# Altium project WTC_SPI_v2.PrjPcb
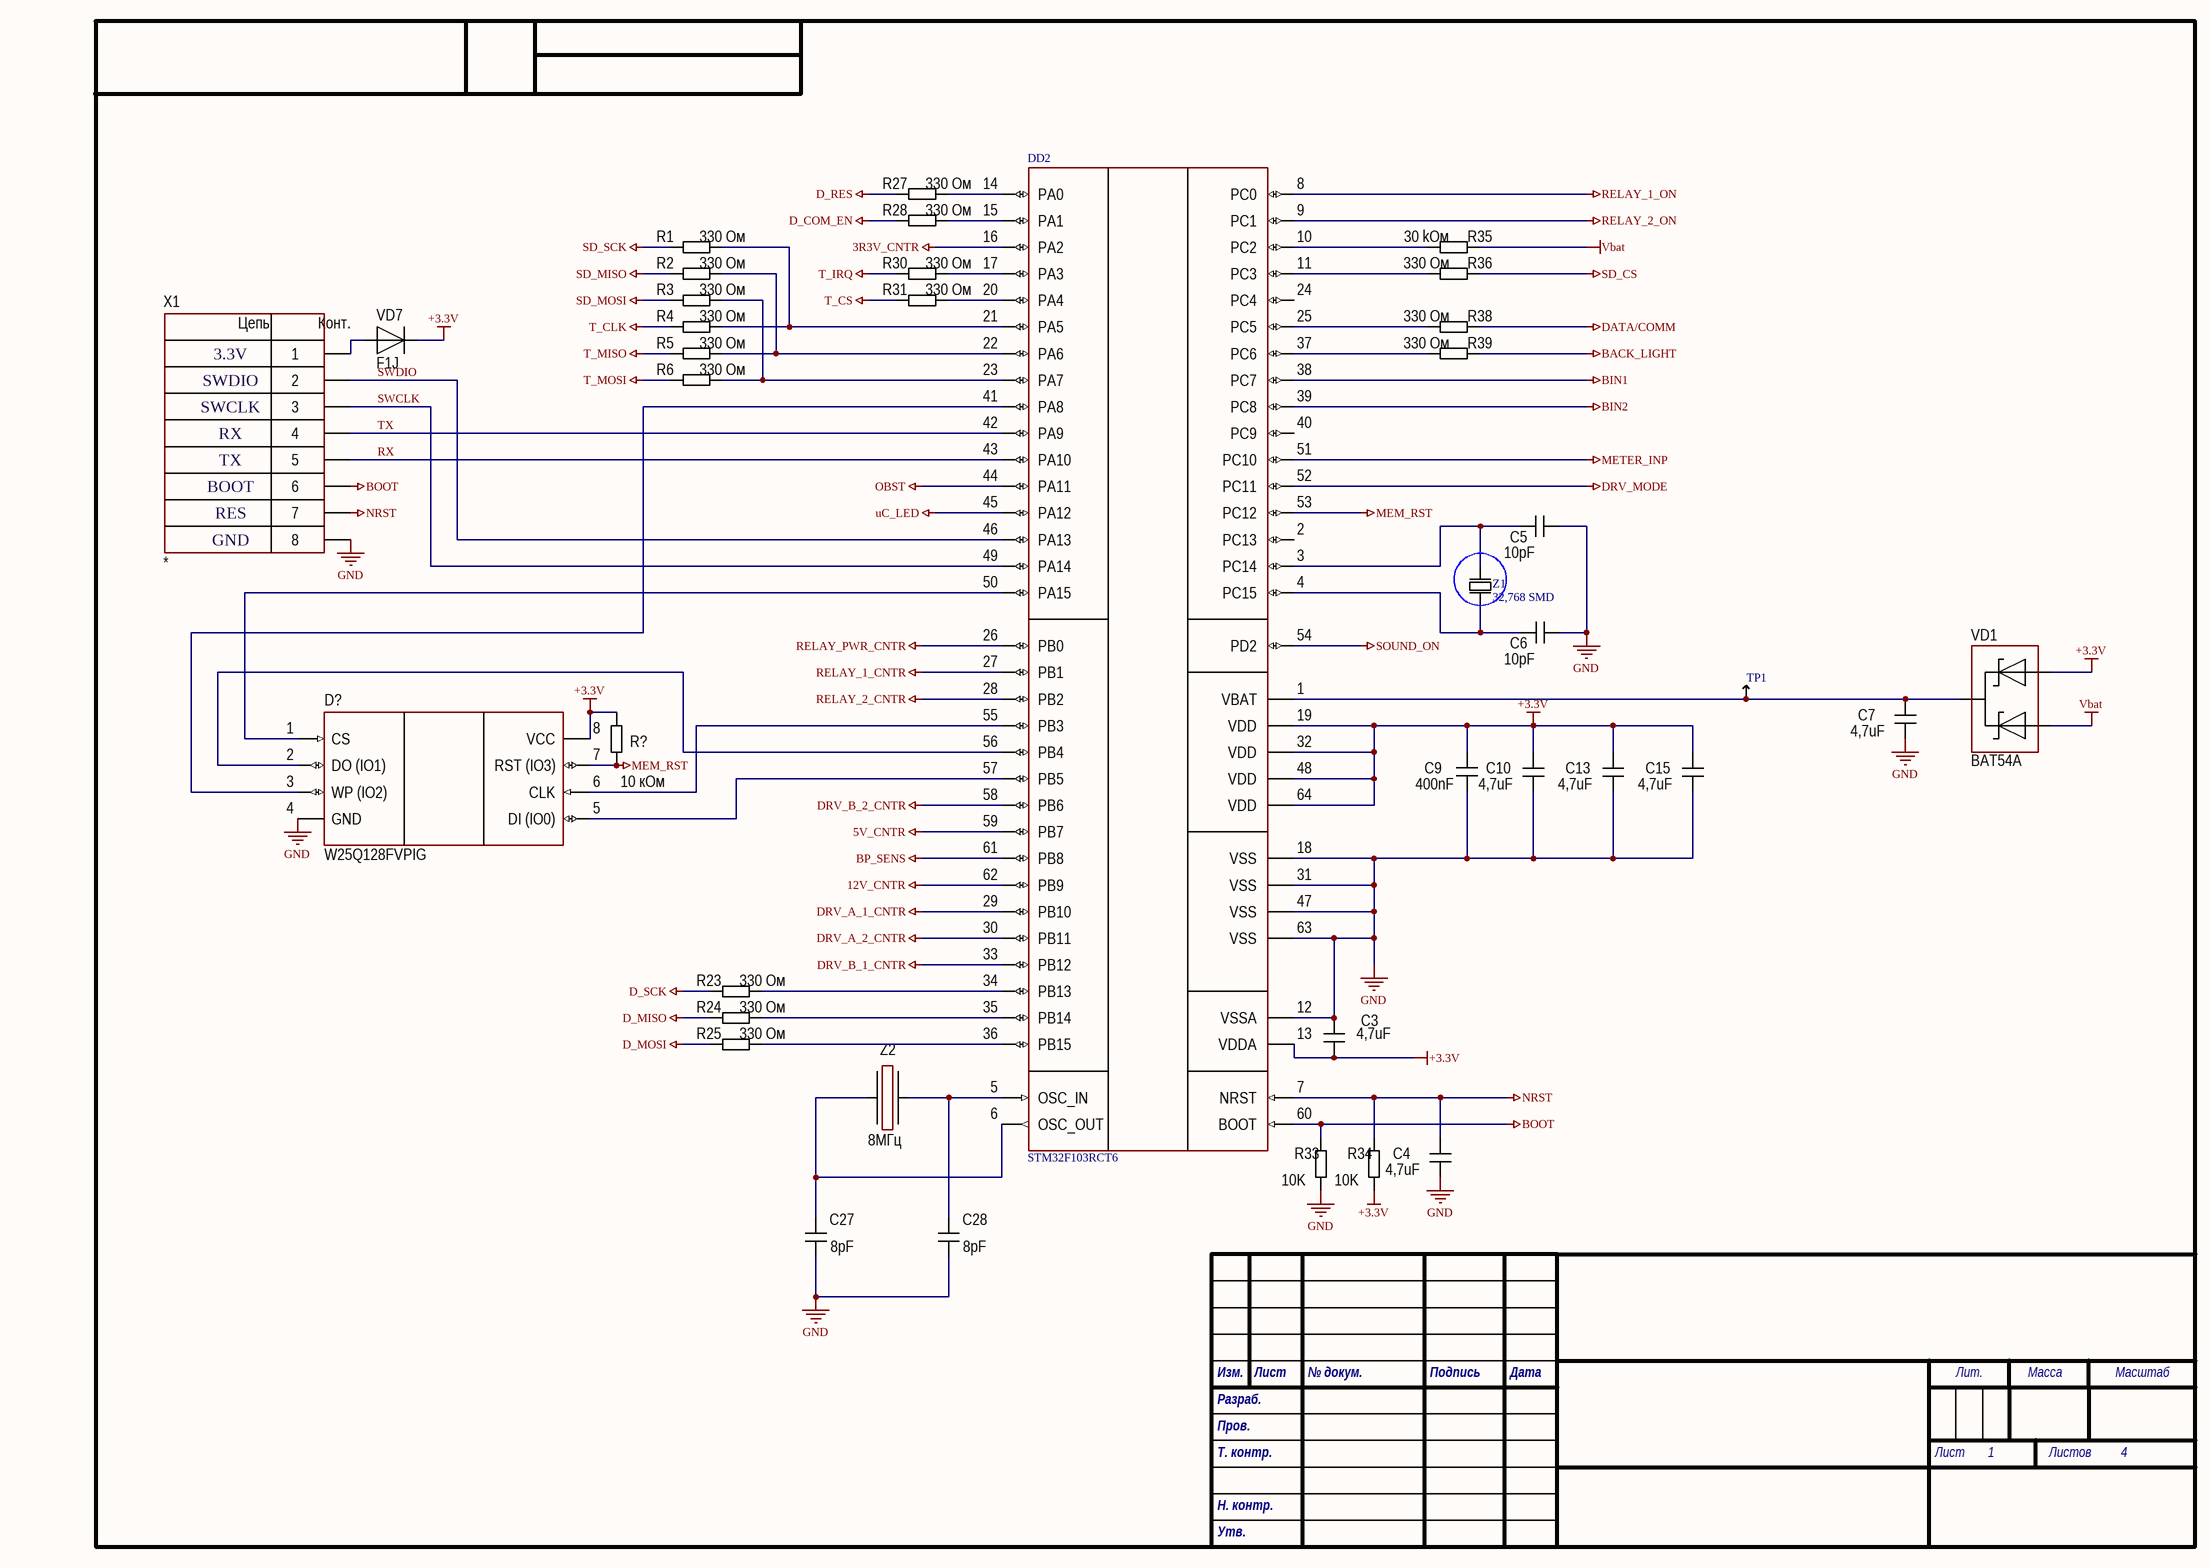
[diagram p0: 1_uC.SchDoc]
4 sheets, 167 parts. Net scope: global (net labels, ports and power ports of the same name join across sheets).
Sheets:
  1_uC.SchDoc
  2_PowerPerif.SchDoc
  3_InfoPerif.SchDoc
  4_PowerSupplie.SchDoc

## Sheet 1_uC.SchDoc
size 414 x 293 mm; SheetNumber: 1; SheetTotal: 4

### Parts
C3  4,7uF  [CH0402C]
C4  4,7uF  [CH0402C]
C5  10pF  [CH0402C]
C6  10pF  [CH0402C]
C7  4,7uF  [CH0402C]
C9  400nF  [CH0402C]
C10  4,7uF  [CH0402C]
C13  4,7uF  [CH0402C]
C15  4,7uF  [CH0402C]
C27  8pF  [CH0402C]
C28  8pF  [CH0402C]
D?  W25Q128FVPIG  [8-WSON (5x6 mm)]
DD2  STM32F103RCT6  [64-LQFP]
R1  330 Ом  [CH0603R]
R2  330 Ом  [CH0603R]
R3  330 Ом  [CH0603R]
R4  330 Ом  [CH0603R]
R5  330 Ом  [CH0603R]
R6  330 Ом  [CH0603R]
R23  330 Ом  [CH0603R]
R24  330 Ом  [CH0603R]
R25  330 Ом  [CH0603R]
R27  330 Ом  [CH0603R]
R28  330 Ом  [CH0603R]
R30  330 Ом  [CH0603R]
R31  330 Ом  [CH0603R]
R33  10K  [CH0805R]
R34  10K  [CH0805R]
R35  30 kОм  [CH0603R]
R36  330 Ом  [CH0603R]
R38  330 Ом  [CH0603R]
R39  330 Ом  [CH0603R]
R?  10 кОм  [CH0603R]
TP1  TestPoint  (value not drawn)
VD1  BAT54A  [SOT23_123]
VD7  F1J  [SOD123F]
X1  *  [CON: PLS-8]
Z1  32,768 SMD  [SMD 32.768KHz]
Z2  8МГц  [OSC: ABM3]

### Nets
3R3V_CNTR: DD2.16(PA2)
5V_CNTR: DD2.59(PB7)
12V_CNTR: DD2.62(PB9)
+3.3V: C3.1 C9.1 C10.2 C13.2 C15.2 D?.8(VCC) DD2.13(VDDA) DD2.19(VDD) DD2.32(VDD) DD2.48(VDD) DD2.64(VDD) R34.1 R?.2 VD1.1 VD7.2
BACK_LIGHT: R39.1
BIN1: DD2.38(PC7)
BIN2: DD2.39(PC8)
BOOT: DD2.60(BOOT) R33.2 X1.6
BP_SENS: DD2.61(PB8)
D_COM_EN: R28.1
D_MISO: R24.1
D_MOSI: R25.1
D_RES: R27.1
D_SCK: R23.1
DATA/COMM: R38.1
DRV_A_1_CNTR: DD2.29(PB10)
DRV_A_2_CNTR: DD2.30(PB11)
DRV_B_1_CNTR: DD2.33(PB12)
DRV_B_2_CNTR: DD2.58(PB6)
DRV_MODE: DD2.52(PC11)
GND: C3.2 C4.1 C5.2 C6.1 C7.1 C9.2 C10.1 C13.1 C15.1 C27.1 C28.1 D?.4(GND) DD2.12(VSSA) DD2.18(VSS) DD2.31(VSS) DD2.47(VSS) DD2.63(VSS) R33.1 X1.8
MEM_RST: D?.7(RST_(IO3)) DD2.53(PC12) R?.1
METER_INP: DD2.51(PC10)
NRST: C4.2 DD2.7(NRST) R34.2 X1.7
OBST: DD2.44(PA11)
RELAY_1_CNTR: DD2.27(PB1)
RELAY_1_ON: DD2.8(PC0)
RELAY_2_CNTR: DD2.28(PB2)
RELAY_2_ON: DD2.9(PC1)
RELAY_PWR_CNTR: DD2.26(PB0)
RX: DD2.43(PA10) X1.5
SD_CS: R36.1
SD_MISO: R2.1
SD_MOSI: R3.1
SD_SCK: R1.1
SOUND_ON: DD2.54(PD2)
T_CLK: R4.1
T_CS: R31.1
T_IRQ: R30.1
T_MISO: R5.1
T_MOSI: R6.1
TX: DD2.42(PA9) X1.4
uC_LED: DD2.45(PA12)
Vbat: R35.1 VD1.3
SWCLK: DD2.49(PA14) X1.3
SWDIO: DD2.46(PA13) X1.2
NetC5_1: C5.1 DD2.3(PC14) Z1.1
NetC6_2: C6.2 DD2.4(PC15) Z1.2
NetC7_2: C7.2 DD2.1(VBAT) TP1.0 VD1.2
NetC27_2: C27.2 DD2.6(OSC_OUT) Z2.1
NetC28_2: C28.2 DD2.5(OSC_IN) Z2.3
NetD?_1: D?.1(CS) DD2.50(PA15)
NetD?_2: D?.2(DO_(IO1)) DD2.56(PB4)
NetD?_3: D?.3(WP_(IO2)) DD2.41(PA8)
NetD?_5: D?.5(DI_(IO0)) DD2.57(PB5)
NetD?_6: D?.6(CLK) DD2.55(PB3)
NetDD2_10: DD2.10(PC2) R35.2
NetDD2_11: DD2.11(PC3) R36.2
NetDD2_14: DD2.14(PA0) R27.2
NetDD2_15: DD2.15(PA1) R28.2
NetDD2_17: DD2.17(PA3) R30.2
NetDD2_20: DD2.20(PA4) R31.2
NetDD2_21: DD2.21(PA5) R1.2 R4.2
NetDD2_22: DD2.22(PA6) R2.2 R5.2
NetDD2_23: DD2.23(PA7) R3.2 R6.2
NetDD2_25: DD2.25(PC5) R38.2
NetDD2_34: DD2.34(PB13) R23.2
NetDD2_35: DD2.35(PB14) R24.2
NetDD2_36: DD2.36(PB15) R25.2
NetDD2_37: DD2.37(PC6) R39.2
NetVD7_1: VD7.1 X1.1

Not connected (* = marked no-connect by the designer): DD2 2(PC13) 24(PC4) 40(PC9)

### Notes on the sheet
- 3.3V
- SWDIO
- SWCLK
- RX
- TX
- BOOT
- RES
- GND
- Изм.
- Лист
- № докум.
- Подпись
- Дата
- Лит.
- Масса
- Масштаб
- Пров.
- Разраб.
- Т. контр.
- Н. контр.
- Листов
- Утв.
- (in symbol 8-Connector) Цепь; Конт.

### Library data of the parts
C3-C6 C9 C10 C13 C15 C27 C28 = Capacitor: 0402; Manufacturer: *; Model: *; HelpURL: *; ComponentKind: *; Value: *
C7 = Capacitor: Manufacturer: *; Model: *; HelpURL: *; ComponentKind: *; Value: *
D? = W25Q128FVPIG: Flash; Manufacturer: Winbond Electronics; Model: W25Q128FVPIG; HelpURL: https://www.digikey.com/product-detail/en/winbond-electronics/W25Q128FVPIG/W25Q128FVPIG-ND/4037386; ComponentKind: 8-WSON
DD2 = STM32F103RCT6: Cortex-M3 (64-LQFP)
R1-R6 R23-R25 R27 R28 R30 R31 R35 R36 R38 R39 R? = Resistor: 0603; Manufacturer: *; Model: *; HelpURL: *; ComponentKind: *; Value: *
R33 R34 = Resistor: 0805; Manufacturer: *; Model: *; HelpURL: *; ComponentKind: *; Value: *
VD1 = Diod Schottky Array v.1: SOT-23; ComponentKind: *; Manufacturer: *; Model: *; HelpURL: *
VD7 = Diod: ComponentKind: *; Manufacturer: *; Model: *; HelpURL: *
X1 = 8-Connector: Pin header 8; Model: *; Manufacturer: *; HelpURL: *; ComponentKind: *
Z1 = Kvarc_32,768: 32,768 kHz SMD 8mm x 3.8mm 12,5pF
Z2 = Oscillator: NX5032GA-8MHz; Manufacturer: *; Model: *; HelpURL: *; ComponentKind: *; Value: *

## Sheet 2_PowerPerif.SchDoc
size 414 x 293 mm; SheetNumber: 2; SheetTotal: 4
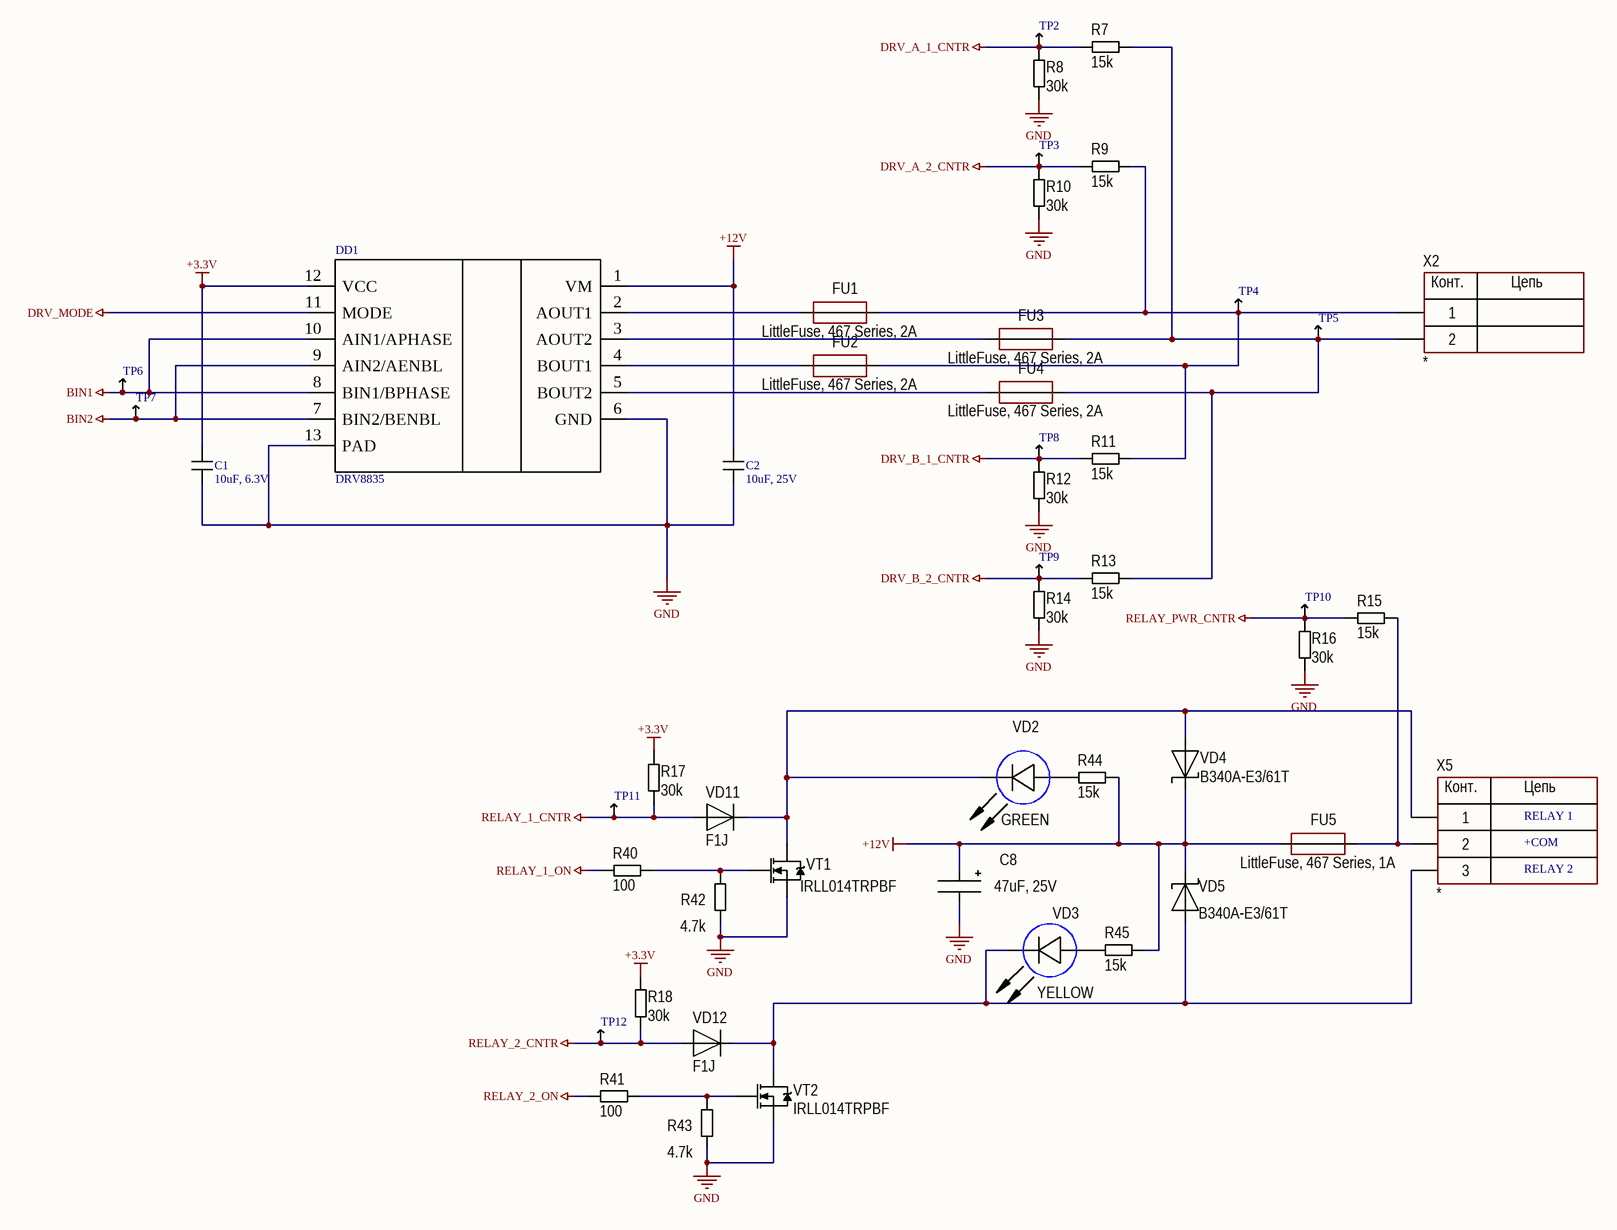
[diagram p1: 2_PowerPerif.SchDoc]

### Parts
C1  10uF, 6.3V  [C_0603]
C2  10uF, 25V  [C_0603]
C8  47uF, 25V  [D8C3.2H12]
DD1  DRV8835  [WSON12]
FU1  LittleFuse, 467 Series, 2A  [CH0603F]
FU2  LittleFuse, 467 Series, 2A  [CH0603F]
FU3  LittleFuse, 467 Series, 2A  [CH0603F]
FU4  LittleFuse, 467 Series, 2A  [CH0603F]
FU5  LittleFuse, 467 Series, 1A  [CH0603F]
R7  15k  [CH0805R]
R8  30k  [CH0805R]
R9  15k  [CH0805R]
R10  30k  [CH0805R]
R11  15k  [CH0805R]
R12  30k  [CH0805R]
R13  15k  [CH0805R]
R14  30k  [CH0805R]
R15  15k  [CH0805R]
R16  30k  [CH0805R]
R17  30k  [CH0805R]
R18  30k  [CH0805R]
R40  100  [CH0805R]
R41  100  [CH0805R]
R42  4.7k  [CH0805R]
R43  4.7k  [CH0805R]
R44  15k  [CH0805R]
R45  15k  [CH0805R]
TP2  TestPoint  (value not drawn)
TP3  TestPoint  (value not drawn)
TP4  TestPoint  (value not drawn)
TP5  TestPoint  (value not drawn)
TP6  TestPoint  (value not drawn)
TP7  TestPoint  (value not drawn)
TP8  TestPoint  (value not drawn)
TP9  TestPoint  (value not drawn)
TP10  TestPoint  (value not drawn)
TP11  TestPoint  (value not drawn)
TP12  TestPoint  (value not drawn)
VD2  GREEN  [CH0603LB]
VD3  YELLOW  [CH0603LB]
VD4  B340A-E3/61T  [SMA]
VD5  B340A-E3/61T  [SMA]
VD11  F1J  [SOD123F]
VD12  F1J  [SOD123F]
VT1  IRLL014TRPBF  [SOT223]
VT2  IRLL014TRPBF  [SOT223]
X2  *  [CON: CWF-2]
X5  *  [CON: 300-03P-5.0]

### Nets
+3.3V: C1.2 DD1.12(VCC) R17.2 R18.2
+12V: C2.2 C8.1 DD1.1(VM) FU5.1 R44.2 R45.2 VD4.2 VD5.2
BIN1: DD1.8(BIN1/BPHASE) DD1.10(AIN1/APHASE) TP6.0
BIN2: DD1.7(BIN2/BENBL) DD1.9(AIN2/AENBL) TP7.0
DRV_A_1_CNTR: R7.1 R8.2 TP2.0
DRV_A_2_CNTR: R9.1 R10.2 TP3.0
DRV_B_1_CNTR: R11.1 R12.2 TP8.0
DRV_B_2_CNTR: R13.1 R14.2 TP9.0
DRV_MODE: DD1.11(MODE)
GND: C1.1 C2.1 C8.2 DD1.6(GND) DD1.13(PAD) R8.1 R10.1 R12.1 R14.1 R16.1 R42.1 R43.1 VT1.3(S) VT2.3(S)
RELAY_1_CNTR: R17.1 TP11.0 VD11.1
RELAY_1_ON: R40.2
RELAY_2_CNTR: R18.1 TP12.0 VD12.1
RELAY_2_ON: R41.2
RELAY_PWR_CNTR: R15.1 R16.2 TP10.0
NetDD1_2: DD1.2(AOUT1) FU1.1
NetDD1_3: DD1.3(AOUT2) FU3.1
NetDD1_4: DD1.4(BOUT1) FU2.1
NetDD1_5: DD1.5(BOUT2) FU4.1
NetFU1_2: FU1.2 FU2.2 R9.2 R11.2 TP4.0 X2.1
NetFU3_2: FU3.2 FU4.2 R7.2 R13.2 TP5.0 X2.2
NetFU5_2: FU5.2 R15.2 X5.2
NetR40_1: R40.1 R42.2 VT1.1(G)
NetR41_1: R41.1 R43.2 VT2.1(G)
NetR44_1: R44.1 VD2.1(A)
NetR45_1: R45.1 VD3.1(A)
NetVD2_2: VD2.2(C) VD4.1 VD11.2 VT1.2(D) X5.1
NetVD3_2: VD3.2(C) VD5.1 VD12.2 VT2.2(D) X5.3

### Notes on the sheet
- RELAY 1
- +COM
- RELAY 2
- Лист
- Изм.
- № докум.
- Подпись
- Дата
- (in symbol 2-Connector) Конт.; Цепь
- (in symbol 3-Connector) Конт.; Цепь

### Library data of the parts
C1 C2 = C_SMD
C8 = AlumCap: Manufacturer: *; Model: *; HelpURL: *; ComponentKind: *; Value: *
DD1 = DRV8835: Driver
FU1-FU5 = Fuse: Manufacturer: *; Model: *; HelpURL: *; ComponentKind: *; Value: *
R7-R18 R40-R45 = Resistor: Manufacturer: *; Model: *; HelpURL: *; ComponentKind: *; Value: *
VD2 VD3 = LED_1: Manufacturer: *; Model: *; HelpURL: *; ComponentKind: *; Value: *
VD4 VD5 = Diod Schottky: ComponentKind: *; Manufacturer: *; Model: *; HelpURL: *
VD11 VD12 = Diod: ComponentKind: *; Manufacturer: *; Model: *; HelpURL: *
VT1 VT2 = N-chanel: Mosfet; Model: *; Manufacturer: *; ComponentKind: *; HelpURL: *
X2 = 2-Connector: Model: *; Manufacturer: *; HelpURL: *; ComponentKind: *
X5 = 3-Connector: Model: *; Manufacturer: *; HelpURL: *; ComponentKind: *

## Sheet 3_InfoPerif.SchDoc
size 414 x 293 mm; SheetNumber: 3; SheetTotal: 4
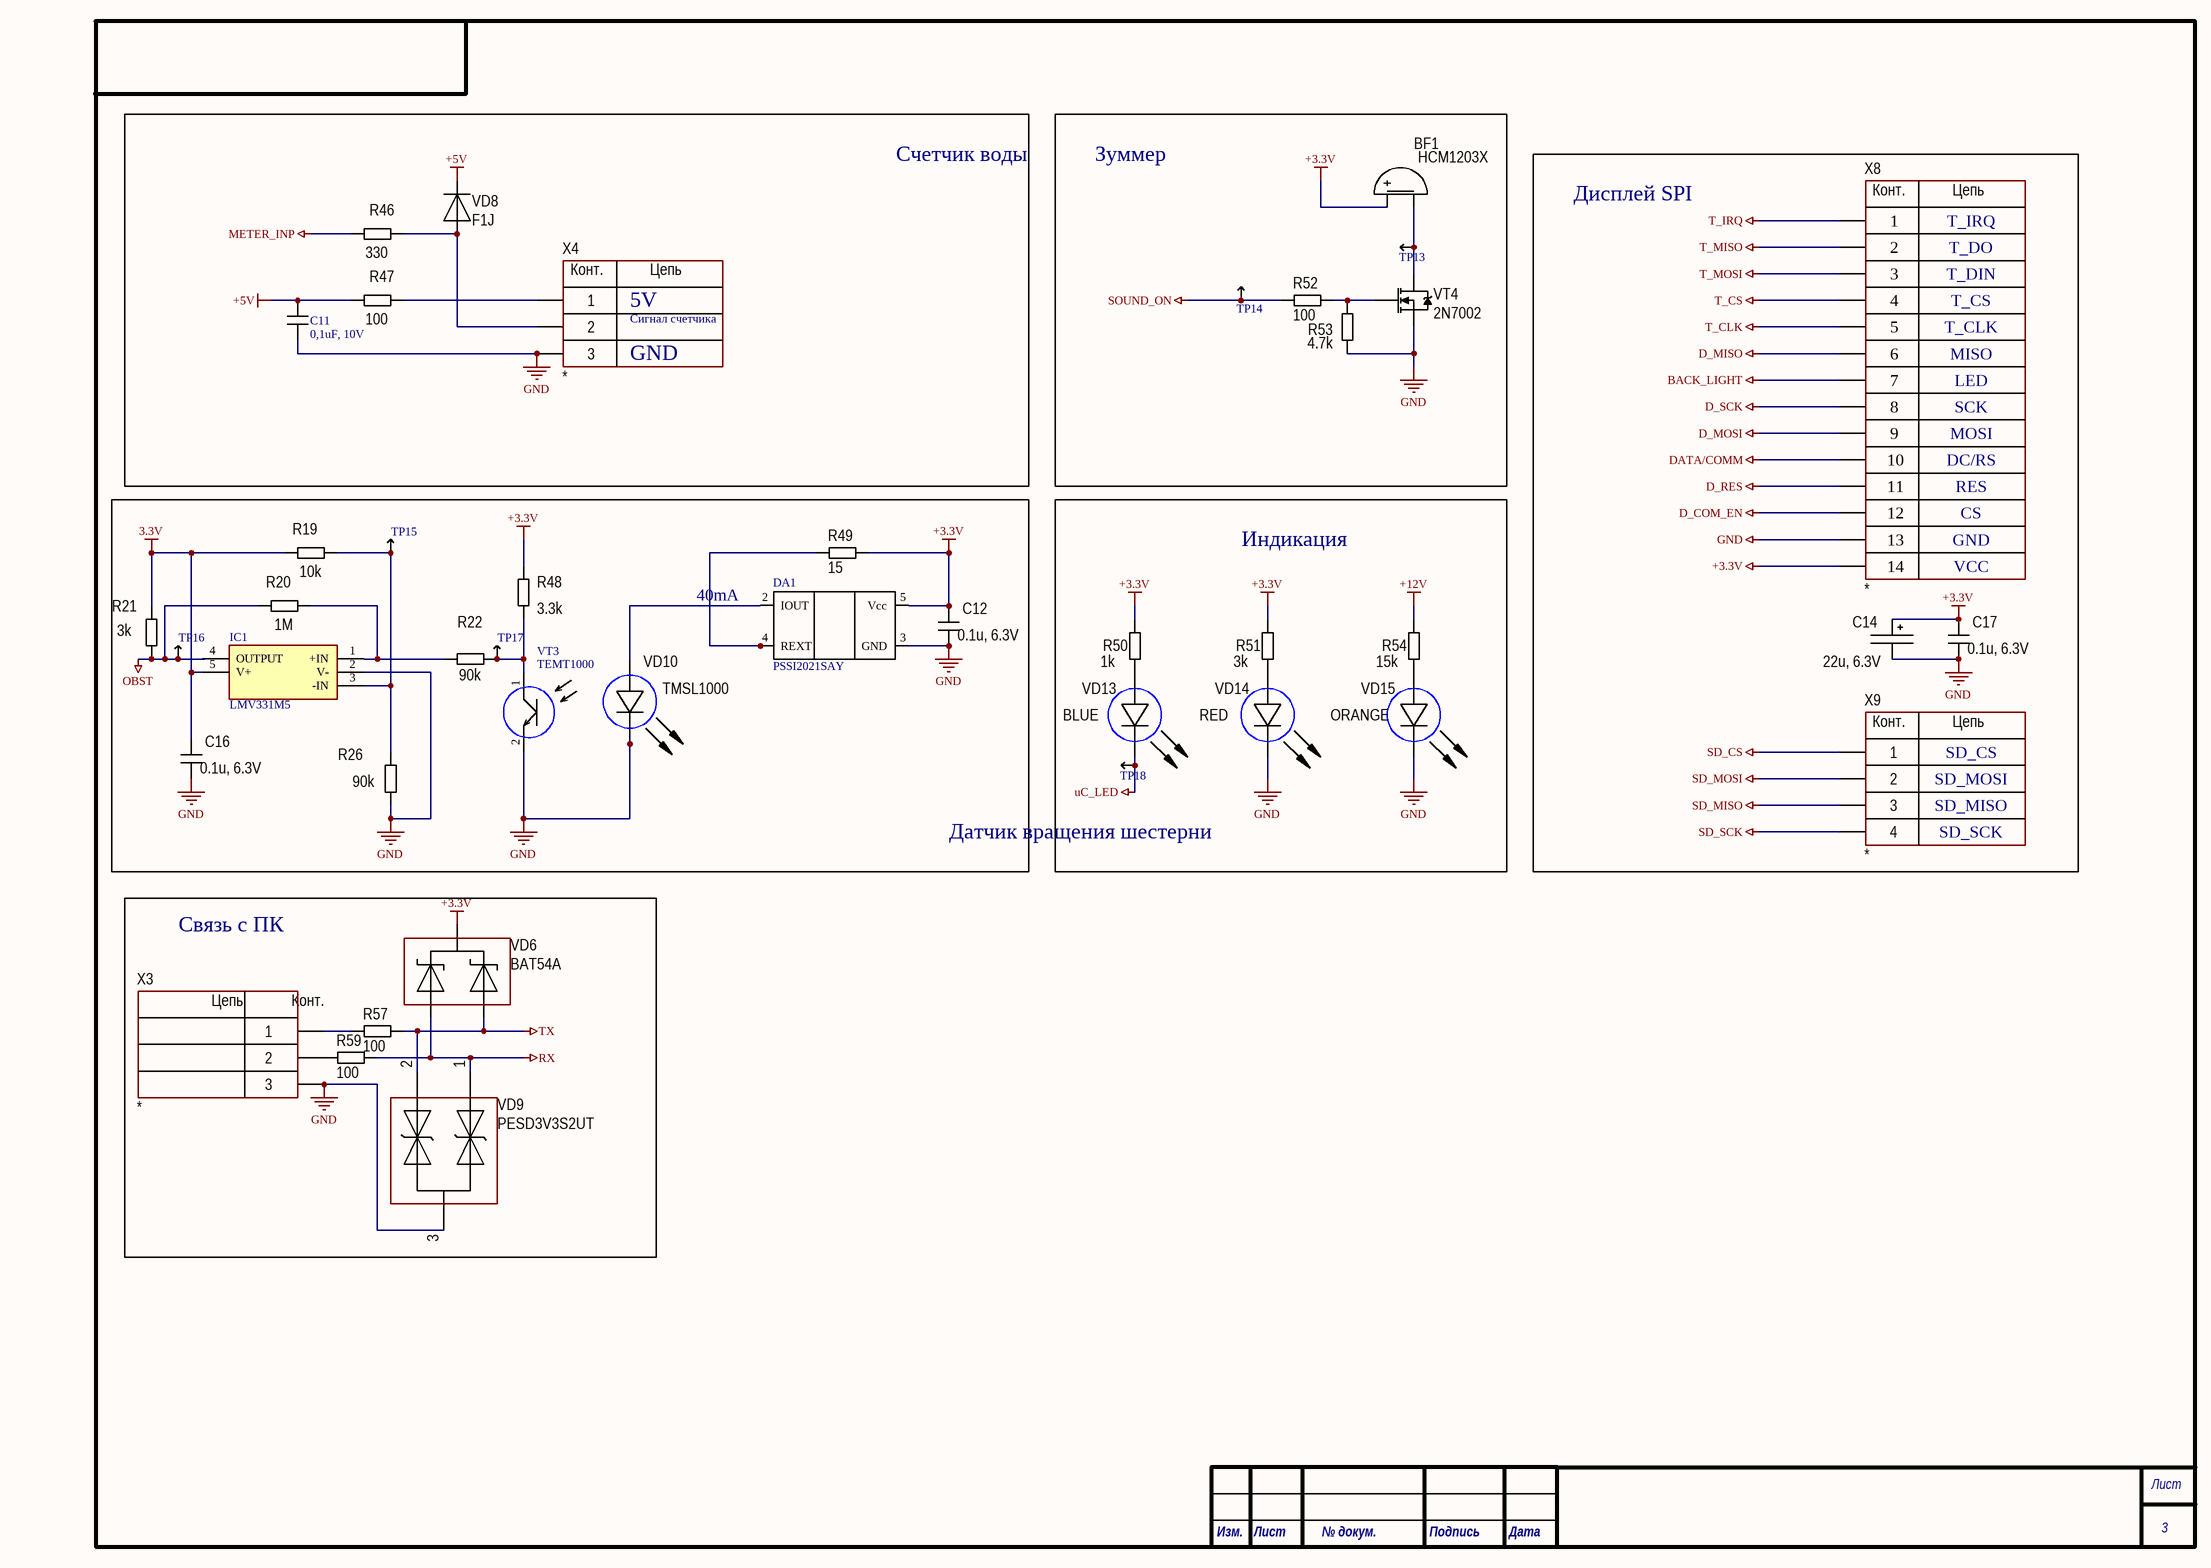
[diagram p2: 3_InfoPerif.SchDoc]

### Parts
BF1  HCM1203X  [BUZ: AI-1223-TWT-3V-2-R]
C11  0,1uF, 10V  [C_0603]
C12  0.1u, 6.3V  [CH0805C]
C14  22u, 6.3V  [TANTAL_B]
C16  0.1u, 6.3V  [CH0805C]
C17  0.1u, 6.3V  [CH0805C]
DA1  PSSI2021SAY  [SOT353]
IC1  LMV331M5  [SOT95P280X145-5N]
R19  10k  [CH0805R]
R20  1M  [CH0805R]
R21  3k  [CH0805R]
R22  90k  [CH0805R]
R26  90k  [CH0805R]
R46  330  [CH0805R]
R47  100  [CH2512R]
R48  3.3k  [CH0805R]
R49  15  [CH0805R]
R50  1k  [CH0805R]
R51  3k  [CH0805R]
R52  100  [CH0805R]
R53  4.7k  [CH0805R]
R54  15k  [CH0805R]
R57  100  [CH0805R]
R59  100  [CH0805R]
TP13  TestPoint  (value not drawn)
TP14  TestPoint  (value not drawn)
TP15  TestPoint  (value not drawn)
TP16  TestPoint  (value not drawn)
TP17  TestPoint  (value not drawn)
TP18  TestPoint  (value not drawn)
VD6  BAT54A  [SOT23_123]
VD8  F1J  [SOD123F]
VD9  PESD3V3S2UT  [SOT23_132]
VD10  TMSL1000  [TSML1000]
VD13  BLUE  [CH0603LB]
VD14  RED  [CH0603LB]
VD15  ORANGE  [CH0603LB]
VT3  TEMT1000  [TEMT1000]
VT4  2N7002  [SOT23_123]
X3  *  [CON: CWF-3]
X4  *  [CON: CWF-3]
X8  *  [DS1024-14]
X9  *  [DS1023-4]

### Blocks framed on the sheet
Зуммер: BF1 R52 R53 TP13 TP14 VT4
Дисплей SPI: C14 C17 X8 X9
Датчик вращения шестерни: C12 C16 DA1 IC1 R19-R22 R26 R48 R49 TP15-TP17 VD10 VT3
Индикация: R50 R51 R54 TP18 VD13-VD15
Связь с ПК: R57 R59 VD6 VD9 X3

### Nets
3.3V: C16.2 IC1.5(V+) R19.2 R21.2
+3.3V: BF1.1(+) C12.2 C14.1 C17.2 R48.2 R49.2 R50.2 R51.2 VD6.2 X8.14
+5V: C11.2 R47.1 VD8.2
+12V: R54.2
BACK_LIGHT: X8.7
D_COM_EN: X8.12
D_MISO: X8.6
D_MOSI: X8.9
D_RES: X8.11
D_SCK: X8.8
DATA/COMM: X8.10
GND: C11.1 C12.1 C14.2 C16.1 C17.1 DA1.3(GND) IC1.2(V-) R26.1 R53.1 VD9.3 VD10.2(C) VD14.2(C) VD15.2(C) VT3.2 VT4.3(S) X3.3 X4.3 X8.13
METER_INP: R46.1
OBST: IC1.4(OUTPUT) R20.2 R21.1 TP16.0
RX: R59.2 VD6.3 VD9.1
SD_CS: X9.1
SD_MISO: X9.3
SD_MOSI: X9.2
SD_SCK: X9.4
SOUND_ON: R52.2 TP14.0
T_CLK: X8.5
T_CS: X8.4
T_IRQ: X8.1
T_MISO: X8.2
T_MOSI: X8.3
TX: R57.2 VD6.1 VD9.2
uC_LED: TP18.0 VD13.2(C)
NetBF1_2: BF1.2(-) TP13.0 VT4.2(D)
NetDA1_2: DA1.2(IOUT) VD10.1(A)
NetDA1_4: DA1.4(REXT) R49.1
NetIC1_1: IC1.1(+IN) R20.1 R22.2
NetIC1_3: IC1.3(-IN) R19.1 R26.2 TP15.0
NetR22_1: R22.1 R48.1 TP17.0 VT3.1
NetR46_2: R46.2 VD8.1 X4.2
NetR47_2: R47.2 X4.1
NetR50_1: R50.1 VD13.1(A)
NetR51_1: R51.1 VD14.1(A)
NetR52_1: R52.1 R53.2 VT4.1(G)
NetR54_1: R54.1 VD15.1(A)
NetR57_1: R57.1 X3.1
NetR59_1: R59.1 X3.2

Not connected (* = marked no-connect by the designer): DA1 5(Vcc)

### Notes on the sheet
- Счетчик воды
- T_IRQ
- 5V
- T_DO
- T_DIN
- T_CS
- GND
- Сигнал счетчика
- T_CLK
- MISO
- LED
- SCK
- MOSI
- DC/RS
- RES
- CS
- VCC
- 40mA
- SD_CS
- SD_MOSI
- SD_MISO
- SD_SCK
- Лист
- Изм.
- № докум.
- Подпись
- Дата
- (in symbol 3-Connector) Конт.; Цепь
- (in symbol 4-Connector) Конт.; Цепь
- (in symbol 14-Connector) Конт.; Цепь

### Library data of the parts
BF1 = Buzzer: Manufacturer: PUI Audio, Inc.; Model: AI-1223-TWT-3V-2-R; HelpURL: https://www.digikey.com/product-detail/en/pui-audio-inc/AI-1223-TWT-3V-2-R/668-1456-ND/5011391; ComponentKind: Internally Driven
C11 = C_SMD
C12 C16 = Capacitor: 0805; Manufacturer: *; Model: *; HelpURL: *; ComponentKind: *; Value: *
C14 = TantalCap: Manufacturer: *; Model: *; HelpURL: *; ComponentKind: *; Value: *
C17 = Capacitor: Manufacturer: *; Model: *; HelpURL: *; ComponentKind: *; Value: *
DA1 = PSSI2021SAY: Iout = 0.617/Rext + 15 µA
IC1 = LMV331M5: Integrated Circuit; Manufacturer_Name: Texas Instruments; Datasheet Link: https://www.ti.com/general/docs/suppproductinfo.tsp?distId=26&gotoUrl=http%3A%2F%2Fwww.ti.com%2Flit%2Fgpn%2Flmv331-n; Height: 1.45mm; Manufacturer_Part_Number: LMV331M5; Mouser Part Number: 926-LMV331M5; Mouser Price/Stock: https://www.mouser.co.uk/ProductDetail/Texas-Instruments/LMV331M5?qs=7lkVKPoqpbaykCAbqlqH9A%3D%3D; Arrow Part Number: LMV331M5; Arrow Price/Stock: https://www.arrow.com/en/products/lmv331m5/texas-instruments?region=nac
R19-R22 R26 R46 R47 R50-R54 R57 R59 = Resistor: Manufacturer: *; Model: *; HelpURL: *; ComponentKind: *; Value: *
R48 R49 = Resistor: 0805; Manufacturer: *; Model: *; HelpURL: *; ComponentKind: *; Value: *
VD6 = Diod Schottky Array v.1: ComponentKind: *; Manufacturer: *; Model: *; HelpURL: *
VD8 = Diod: ComponentKind: *; Manufacturer: *; Model: *; HelpURL: *
VD9 = TVS Array: ComponentKind: *; Manufacturer: *; Model: *; HelpURL: *
VD10 VD13-VD15 = LED_1: Manufacturer: *; Model: *; HelpURL: *; ComponentKind: *; Value: *
VT4 = N-chanel: Mosfet; Model: *; Manufacturer: *; ComponentKind: *; HelpURL: *
X3 X4 = 3-Connector: Model: *; Manufacturer: *; HelpURL: *; ComponentKind: *
X8 = 14-Connector: Model: *; Manufacturer: *; HelpURL: *; ComponentKind: *
X9 = 4-Connector: Model: *; Manufacturer: *; HelpURL: *; ComponentKind: *

## Sheet 4_PowerSupplie.SchDoc
size 414 x 293 mm; SheetNumber: 4; SheetTotal: 4; PageSetup: Record=PageOptionsZCenterHorizontal=TrueZCenterVertical=TrueZPrintScale=1.00ZXCorrection=0.00ZYCorrection=0.00ZPrintKind=1ZBorderSize=5000000ZLeftOffset=0ZBottomOffset=0ZOrientation=2ZPaperLength=1000ZPaperWidth=1000ZScale=100ZPaperSource=7ZPrintQuality=-4ZMediaType=1ZDitherType=10ZPaperKind=A3ZPrintScaleMode=0; Razrabotal: {Разработал}; Proveril: {Проверил}; Tkontr: {Т.контр.}; Nkontr: {Н.контр.}; Ytverdil: {Утвердил}; Nazvanie1: {Название1}; Nazvanie2: {Название2}; Oboznachenie: {Обозначение}
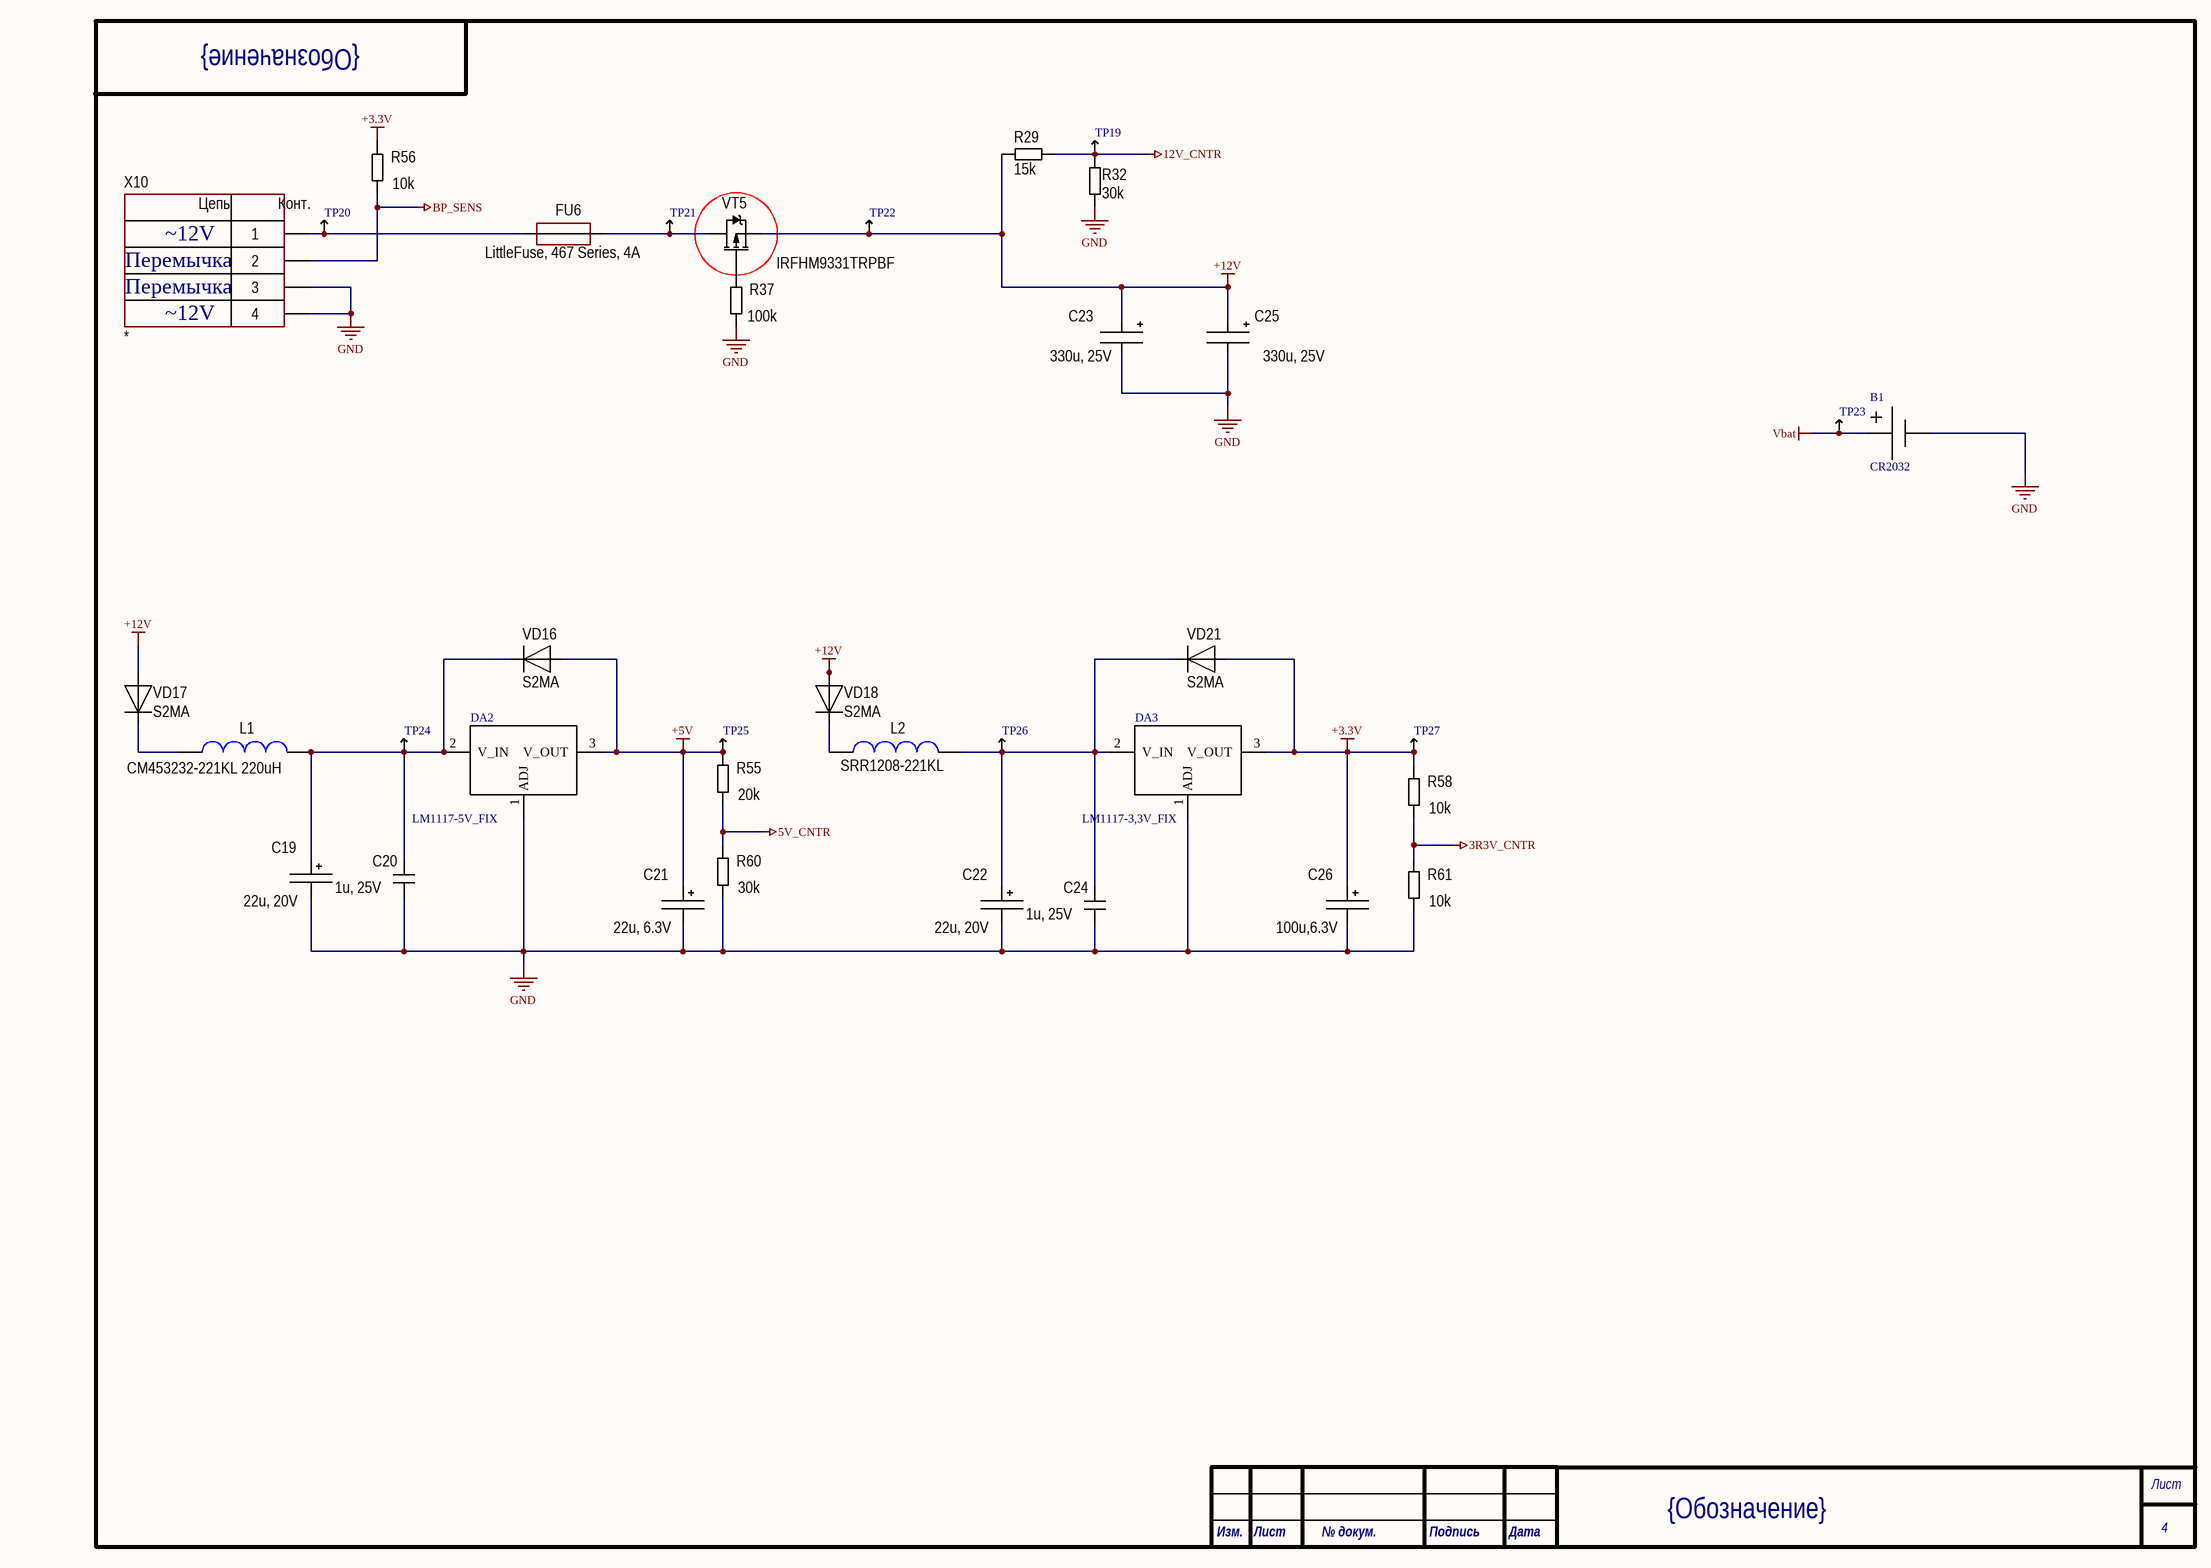
[diagram p3: 4_PowerSupplie.SchDoc]

### Parts
B1  CR2032  [CR2032]
C19  22u, 20V  [TANTAL_B]
C20  1u, 25V  [CH0805C]
C21  22u, 6.3V  [TANTAL_B]
C22  22u, 20V  [TANTAL_B]
C23  330u, 25V  [D10C4.4H10]
C24  1u, 25V  [CH0805C]
C25  330u, 25V  [D10C4.4H10]
C26  100u,6.3V  [TANTAL_B]
DA2  LM1117-5V_FIX  [SOT223_123]
DA3  LM1117-3,3V_FIX  [SOT223_123]
FU6  LittleFuse, 467 Series, 4A  [CH0603F]
L1  CM453232-221KL 220uH  [IND:1812]
L2  SRR1208-221KL  [IND: SRR1208]
R29  15k  [CH0805R]
R32  30k  [CH0805R]
R37  100k  [CH0805R]
R55  20k  [CH0805R]
R56  10k  [CH0805R]
R58  10k  [CH0805R]
R60  30k  [CH0805R]
R61  10k  [CH0805R]
TP19  TestPoint  (value not drawn)
TP20  TestPoint  (value not drawn)
TP21  TestPoint  (value not drawn)
TP22  TestPoint  (value not drawn)
TP23  TestPoint  (value not drawn)
TP24  TestPoint  (value not drawn)
TP25  TestPoint  (value not drawn)
TP26  TestPoint  (value not drawn)
TP27  TestPoint  (value not drawn)
VD16  S2MA  [SMA]
VD17  S2MA  [SMA]
VD18  S2MA  [SMA]
VD21  S2MA  [SMA]
VT5  IRFHM9331TRPBF  [SOT223]
X10  *  [CON: CWF-4]

### Nets
3R3V_CNTR: R58.1 R61.2
5V_CNTR: R55.1 R60.2
12V_CNTR: R29.1 R32.2 TP19.0
+3.3V: C26.1 DA3.3(V_OUT) R56.2 R58.2 TP27.0 VD21.1
+5V: C21.1 DA2.3(V_OUT) R55.2 TP25.0 VD16.1
+12V: C23.1 C25.1 R29.2 TP22.0 VD17.1 VD18.1 VT5.3(S)
BP_SENS: R56.1 X10.2
GND: B1.2 C19.2 C20.1 C21.2 C22.2 C23.2 C24.1 C25.2 C26.2 DA2.1(ADJ) DA3.1(ADJ) R32.1 R37.1 R60.1 R61.1 X10.3 X10.4
Vbat: B1.1 TP23.0
NetC19_1: C19.1 C20.2 DA2.2(V_IN) L1.1 TP24.0 VD16.2
NetC22_1: C22.1 C24.2 DA3.2(V_IN) L2.1 TP26.0 VD21.2
NetFU6_1: FU6.1 TP20.0 X10.1
NetFU6_2: FU6.2 TP21.0 VT5.2(D)
NetL1_2: L1.2 VD17.2
NetL2_2: L2.2 VD18.2
NetR37_2: R37.2 VT5.1(G)

### Notes on the sheet
- Перемычка
- ~12V
- Лист
- Изм.
- № докум.
- Подпись
- Дата
- (in symbol 4-Connector) Цепь; Конт.

### Library data of the parts
B1 = Battery_CR2032
C19 C21 C22 C26 = TantalCap: Manufacturer: *; Model: *; HelpURL: *; ComponentKind: *; Value: *
C20 C24 = Capacitor: Manufacturer: *; Model: *; HelpURL: *; ComponentKind: *; Value: *
C23 C25 = AlumCap: Manufacturer: *; Model: *; HelpURL: *; ComponentKind: *; Value: *
DA2 DA3 = LM1117
FU6 = Fuse: Manufacturer: *; Model: *; HelpURL: *; ComponentKind: *; Value: *
L1 L2 = Inductor: Manufacturer: *; Model: *; HelpURL: *; ComponentKind: *; Value: *
R29 R32 R37 R55 R56 R58 R60 R61 = Resistor: Manufacturer: *; Model: *; HelpURL: *; ComponentKind: *; Value: *
VD16-VD18 VD21 = Diod: ComponentKind: *; Manufacturer: *; Model: *; HelpURL: *
VT5 = P-chanel: Mosfet; Model: *; Manufacturer: *; ComponentKind: *; HelpURL: *
X10 = 4-Connector: Model: *; Manufacturer: *; HelpURL: *; ComponentKind: *

## Nets that join several sheets
3R3V_CNTR: 1_uC (DD2.16), 4_PowerSupplie (R58.1 R61.2)
5V_CNTR: 1_uC (DD2.59), 4_PowerSupplie (R55.1 R60.2)
12V_CNTR: 1_uC (DD2.62), 4_PowerSupplie (R29.1 R32.2 TP19.0)
+3.3V: 1_uC (15 pins), 2_PowerPerif (C1.2 DD1.12 R17.2 R18.2), 3_InfoPerif (10 pins), 4_PowerSupplie (6 pins)
+5V: 3_InfoPerif (C11.2 R47.1 VD8.2), 4_PowerSupplie (5 pins)
+12V: 2_PowerPerif (8 pins), 3_InfoPerif (R54.2), 4_PowerSupplie (7 pins)
BACK_LIGHT: 1_uC (R39.1), 3_InfoPerif (X8.7)
BIN1: 1_uC (DD2.38), 2_PowerPerif (DD1.8 DD1.10 TP6.0)
BIN2: 1_uC (DD2.39), 2_PowerPerif (DD1.7 DD1.9 TP7.0)
BP_SENS: 1_uC (DD2.61), 4_PowerSupplie (R56.1 X10.2)
D_COM_EN: 1_uC (R28.1), 3_InfoPerif (X8.12)
D_MISO: 1_uC (R24.1), 3_InfoPerif (X8.6)
D_MOSI: 1_uC (R25.1), 3_InfoPerif (X8.9)
D_RES: 1_uC (R27.1), 3_InfoPerif (X8.11)
D_SCK: 1_uC (R23.1), 3_InfoPerif (X8.8)
DATA/COMM: 1_uC (R38.1), 3_InfoPerif (X8.10)
DRV_A_1_CNTR: 1_uC (DD2.29), 2_PowerPerif (R7.1 R8.2 TP2.0)
DRV_A_2_CNTR: 1_uC (DD2.30), 2_PowerPerif (R9.1 R10.2 TP3.0)
DRV_B_1_CNTR: 1_uC (DD2.33), 2_PowerPerif (R11.1 R12.2 TP8.0)
DRV_B_2_CNTR: 1_uC (DD2.58), 2_PowerPerif (R13.1 R14.2 TP9.0)
DRV_MODE: 1_uC (DD2.52), 2_PowerPerif (DD1.11)
GND: 1_uC (19 pins), 2_PowerPerif (14 pins), 3_InfoPerif (18 pins), 4_PowerSupplie (17 pins)
METER_INP: 1_uC (DD2.51), 3_InfoPerif (R46.1)
OBST: 1_uC (DD2.44), 3_InfoPerif (IC1.4 R20.2 R21.1 TP16.0)
RELAY_1_CNTR: 1_uC (DD2.27), 2_PowerPerif (R17.1 TP11.0 VD11.1)
RELAY_1_ON: 1_uC (DD2.8), 2_PowerPerif (R40.2)
RELAY_2_CNTR: 1_uC (DD2.28), 2_PowerPerif (R18.1 TP12.0 VD12.1)
RELAY_2_ON: 1_uC (DD2.9), 2_PowerPerif (R41.2)
RELAY_PWR_CNTR: 1_uC (DD2.26), 2_PowerPerif (R15.1 R16.2 TP10.0)
RX: 1_uC (DD2.43 X1.5), 3_InfoPerif (R59.2 VD6.3 VD9.1)
SD_CS: 1_uC (R36.1), 3_InfoPerif (X9.1)
SD_MISO: 1_uC (R2.1), 3_InfoPerif (X9.3)
SD_MOSI: 1_uC (R3.1), 3_InfoPerif (X9.2)
SD_SCK: 1_uC (R1.1), 3_InfoPerif (X9.4)
SOUND_ON: 1_uC (DD2.54), 3_InfoPerif (R52.2 TP14.0)
T_CLK: 1_uC (R4.1), 3_InfoPerif (X8.5)
T_CS: 1_uC (R31.1), 3_InfoPerif (X8.4)
T_IRQ: 1_uC (R30.1), 3_InfoPerif (X8.1)
T_MISO: 1_uC (R5.1), 3_InfoPerif (X8.2)
T_MOSI: 1_uC (R6.1), 3_InfoPerif (X8.3)
TX: 1_uC (DD2.42 X1.4), 3_InfoPerif (R57.2 VD6.1 VD9.2)
uC_LED: 1_uC (DD2.45), 3_InfoPerif (TP18.0 VD13.2)
Vbat: 1_uC (R35.1 VD1.3), 4_PowerSupplie (B1.1 TP23.0)